# Altium schematic sheet RemoteSch.SchDoc: Remote Controller
size A3; Author: Neil Patil, Harris Tomy; Organization: The University of Auckland; Address1: Building 405; Address2: 20 Symonds Street; Address3: Auckland, 1010; Address4: New Zealand; Revision: 1R0; SheetNumber: 1; SheetTotal: ?
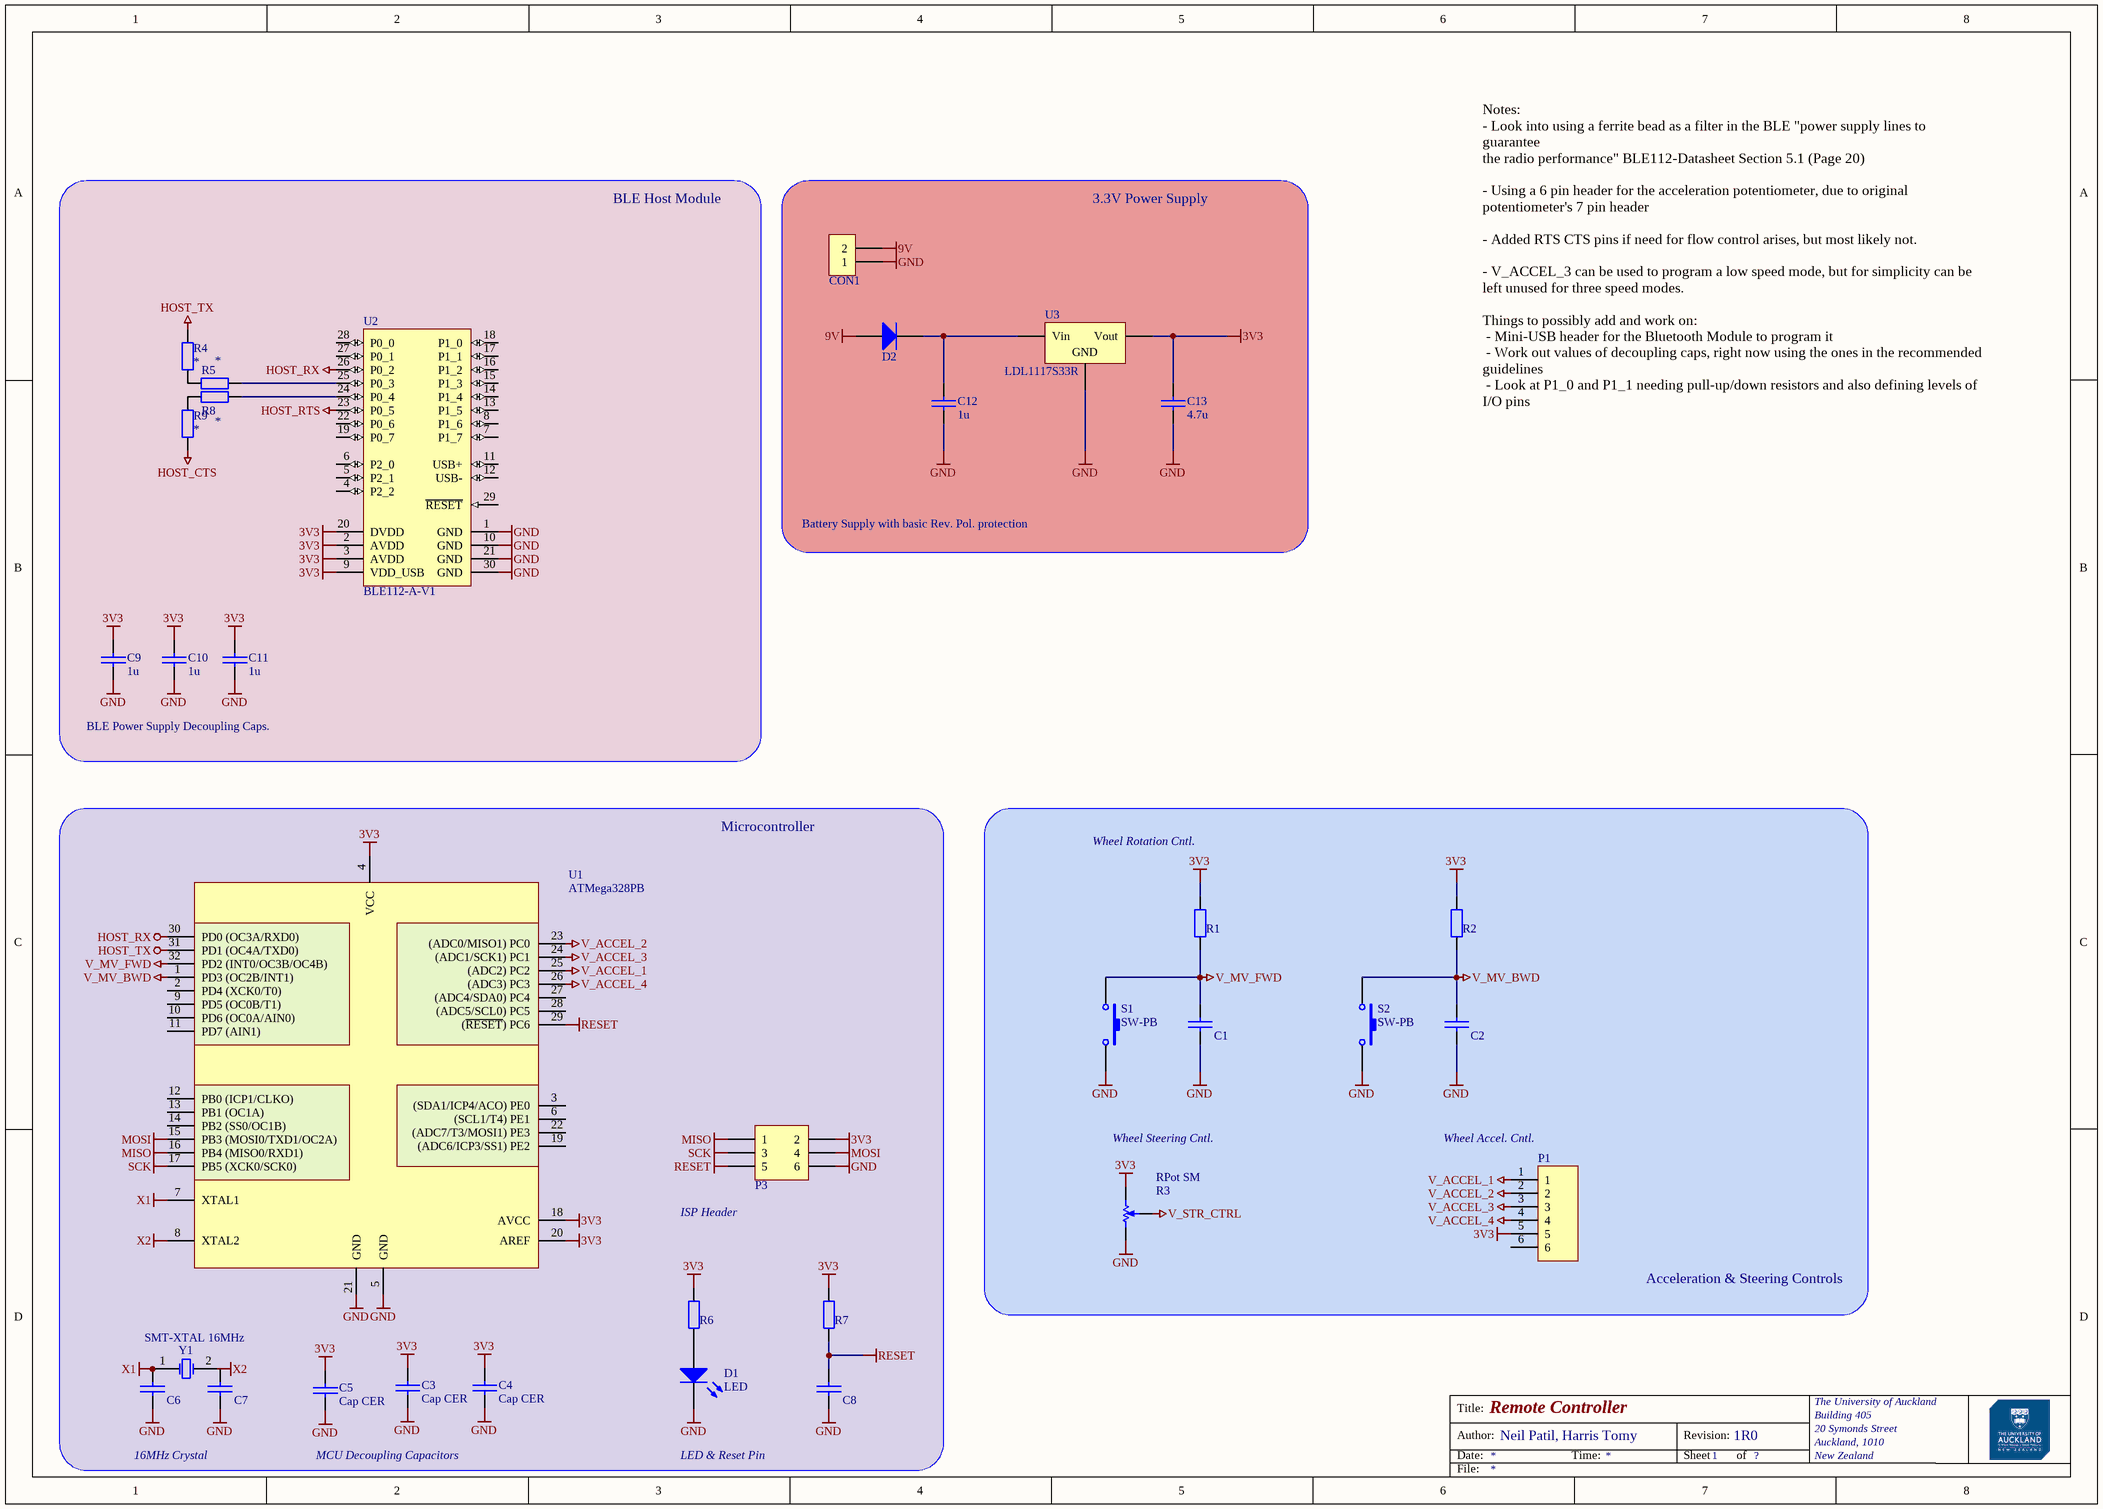
[diagram p0: RemoteSch.SchDoc]

## Parts
C1  Capacitor 0805  [C0805]  (value not drawn)
C2  Capacitor 0805  [C0805]  (value not drawn)
C3  Cap CER  [C1206]
C4  Cap CER  [C1206]
C5  Cap CER  [C1206]
C6  CCAP1210  [C1210]  (value not drawn)
C7  CCAP1210  [C1210]  (value not drawn)
C8  CCAP1210  [C1210]  (value not drawn)
C9  value 1u  [C0805]  (hidden comment: Capacitor 0805)
C10  value 1u  [C0805]  (hidden comment: Capacitor 0805)
C11  value 1u  [C0805]  (hidden comment: Capacitor 0805)
C12  1u  [C1210]
C13  4.7u  [C1210]
CON1  Header 2X1  [HDR2X1_2P54]  (value not drawn)
D1  LED  [R0805]
D2  Diode  [DAX4]  (value not drawn)
P1  Header 6X1  [HDR6X1_2P54]  (value not drawn)
P3  HDR3X2  [HDR2X3_2P54]  (value not drawn)
R1  Resistor 0805  [R0805]  (value not drawn)
R2  Resistor 0805  [R0805]  (value not drawn)
R3  RPot SM  [POT4MM-2]
R4  *  [0805 RES]
R5  *  [0805 RES]
R6  Resistor 1206  [R1206]  (value not drawn)
R7  Resistor 1206  [R1206]  (value not drawn)
R8  *  [0805 RES]
R9  *  [0805 RES]
S1  SW-PB  [SPST-2]
S2  SW-PB  [SPST-2]
U1  ATMega328PB  [TQFP32]
U2  BLE112-A-V1  [BLUE-BLE112-A-V1_V]
U3  LDL1117S33R  [SOT223L]
Y1  SMT-XTAL 16MHz  [HC49-US]

## Blocks framed on the sheet
BLE Host Module: C9-C11 R4 R5 R8 R9 U2
3.3V Power Supply: C12 C13 CON1 D2 U3
Microcontroller: C3-C8 D1 P3 R6 R7 U1 Y1
Acceleration & Steering Controls: C1 C2 P1 R1-R3 S1 S2

## Nets
3V3: C3.2 C4.2 C5.2 C9.2 C10.2 C11.2 C13.2 P1.5 P3.2 R1.1 R2.1 R3.CW(+) R6.2 R7.2 U1.4(VCC) U1.18(AVCC) U1.20(AREF) U2.2(AVDD) U2.3(AVDD) U2.9(VDD_USB) U2.20(DVDD) U3.2(Vout)
9V: CON1.2 D2.1
GND: C1.1 C2.1 C3.1 C4.1 C5.1 C6.1 C7.1 C8.1 C9.1 C10.1 C11.1 C12.1 C13.1 CON1.1 D1.2(K) P3.6 R3.CCW(-) S1.2 S2.2 U1.5(GND) U1.21(GND) U2.1(GND) U2.10(GND) U2.21(GND) U2.30(GND) U3.1(GND)
HOST_CTS: R9.1
HOST_RTS: U2.23(P0_5)
HOST_RX: U1.30(PD0_(OC3A/RXD0)) U2.26(P0_2)
HOST_TX: R4.1 U1.31(PD1_(OC4A/TXD0))
MISO: P3.1 U1.16(PB4_(MISO0/RXD1))
MOSI: P3.4 U1.15(PB3_(MOSI0/TXD1/OC2A))
RESET: C8.2 P3.5 R7.1 U1.29((~{RESET})_PC6)
SCK: P3.3 U1.17(PB5_(XCK0/SCK0))
V_ACCEL_1: P1.1 U1.25((ADC2)_PC2)
V_ACCEL_2: P1.2 U1.23((ADC0/MISO1)_PC0)
V_ACCEL_3: P1.3 U1.24((ADC1/SCK1)_PC1)
V_ACCEL_4: P1.4 U1.26((ADC3)_PC3)
V_MV_BWD: C2.2 R2.2 S2.1 U1.1(PD3_(OC2B/INT1))
V_MV_FWD: C1.2 R1.2 S1.1 U1.32(PD2_(INT0/OC3B/OC4B))
V_STR_CTRL: R3.W
X1: C6.2 U1.7(XTAL1) Y1.1(OSC1)
X2: U1.8(XTAL2)
NetC7_2: C7.2 Y1.2(OSC2)
NetC12_2: C12.2 D2.2 U3.3(Vin)
NetD1_1: D1.1(A) R6.1
NetR4_2: R4.2 R5.1
NetR5_2: R5.2 U2.25(P0_3)
NetR8_1: R8.1 R9.2
NetR8_2: R8.2 U2.24(P0_4)

Not connected (* = marked no-connect by the designer): P1 6; U1 2(PD4_(XCK0/T0)) 3((SDA1/ICP4/ACO)_PE0) 6((SCL1/T4)_PE1) 9(PD5_(OC0B/T1)) 10(PD6_(OC0A/AIN0)) 11(PD7_(AIN1)) 12(PB0_(ICP1/CLKO)) 13(PB1_(OC1A)) 14(PB2_(SS0/OC1B)) 19((ADC6/ICP3/SS1)_PE2) 22((ADC7/T3/MOSI1)_PE3) 27((ADC4/SDA0)_PC4) 28((ADC5/SCL0)_PC5); U2 4(P2_2) 5(P2_1) 6(P2_0) 7(P1_7) 8(P1_6) 11(USB+) 12(USB-) 13(P1_5) 14(P1_4) 15(P1_3) 16(P1_2) 17(P1_1) 18(P1_0) 19(P0_7) 22(P0_6) 27(P0_1) 28(P0_0) 29(~{RESET})

## Notes on the sheet
- Notes:
  - Look into using a ferrite bead as a filter in the BLE "power supply lines to guarantee
  the radio performance" BLE112-Datasheet Section 5.1 (Page 20)
  - Using a 6 pin header for the acceleration potentiometer, due to original potentiometer's 7 pin header
  - Added RTS CTS pins if need for flow control arises, but most likely not.
  - V_ACCEL_3 can be used to program a low speed mode, but for simplicity can be left unused for three speed modes.
  Things to possibly add and work on:
  - Mini-USB header for the Bluetooth Module to program it
  - Work out values of decoupling caps, right now using the ones in the recommended guidelines
  - Look at P1_0 and P1_1 needing pull-up/down resistors and also defining levels of I/O pins
- Battery Supply with basic Rev. Pol. protection
- BLE Power Supply Decoupling Caps.
- Wheel Rotation Cntl.
- Wheel Steering Cntl.
- (near P1) Wheel Accel. Cntl.
- (near P3) ISP Header
- 16MHz Crystal
- MCU Decoupling Capacitors
- LED & Reset Pin
- Labels drawn without touching a wire or pin: X2
- Title:
- Author:
- Date:
- Time:
- Revision:
- Sheet
- of
- File:

## Library data of the parts
C1 C2 = CCAP0805
C3-C5 = Cap CER Decoup C3216C0G2A104J160AC: CAP CER 0.1UF 100V C0G 1206; Manufacturer: TDK Corporation; Type: Surface mount; Value: 100nF/100V; Supplier 1: RSComponents; Supplier Part Number 1: 1795799; MPN: C3216C0G2A104J160AC; Supplier 2: Element14; Part Description: CAP CER 0.1UF 100V C0G 1206; Supplier Part Number 4: 810-C3216C0G2A104J6C; Supplier Part Number 3: 445-172677-1-ND; Supplier Part Number 2: 2906828; Supplier 4: Mouser; Supplier 3: Digi-Key
C6 C7 = CCAP1210: Type: Surface Mount; Value: 18p; MPN: ?; Part Description: ?
C9-C11 = CCAP0805: Type: Surface Mount; MPN: ?; Part Description: ?
C12 C13 = Cap CER HF DC-Link CL32B225KCJSNNE: CAP CER 2.2UF 100V X7R 1210; Manufacturer: AVX Corporation; Type: Surface mount; Value: 2200nF/100V; MPN: CL32B225KCJSNNE; Part Description: CAP CER 2.2UF 100V X7R 1210; Supplier 1: Digi-Key; Supplier Part Number 1: 1276-3362-1-ND; Supplier 2: Arrow
CON1 = HDR2X1
P1 = HDR6X1: Header, 6-Pin; LatestRevisionDate: 17-Jul-2002; LatestRevisionNote: Re-released for DXP Platform.; Publisher: Altium Limited
P3 = HDR3X2: Header, 3-Pin, Dual row
R1 R2 = RES0805
R3 = RPot SM: Square Trimming Potentiometer; Published: 17-Dec-2003; DatasheetVersion: Oct-2003; PackageReference: POT4MM-2; Publisher: Altium Limited; PackageDescription: Square Trimming Potentiometer; ComponentLink1Description: Manufacturer Link; ComponentLink1URL: http://bourns.com/2/search.html
R4 R5 R8 R9 = Res_SMT_0805: 0805 resistor; Published: 8-Jun-2000; LatestRevisionDate: 17-Jul-2002; LatestRevisionNote: Re-released for DXP Platform.; PackageReference: AXIAL-0.4; Publisher: Altium Limited; Value: *; ComponentLink1Description: https://nz.mouser.com/datasheet/2/315/AOA0000C304-1149620.pdf
R6 R7 = RES1206
S1 S2 = SW-PB: Switch; Published: 24-Mar-1999; LatestRevisionDate: 17-Jul-2002; LatestRevisionNote: Re-released for DXP Platform.; PackageReference: SPST-2; Publisher: Altium Limited; PackageDescription: Switch; 2 Leads
U1 = ATMega328PB: IC MCU 8BIT 32KB FLASH 32TQFP; Supplier 1: Digi-Key; Supplier Part Number 1: ATMEGA328PB-AU-ND; Supplier 2: Digikey; Supplier Part Number 2: ATMEGA328PB-AU-ND
U2 = BLE112-A-V1: Bluetooth(R) Low Energy Single Mode Module / , 2 to 3.6 V, -40 to 85 degC, 30-Pin SMD, RoHS, Tape and Reel; Min Supply Voltage: 2.1 V; Max Supply Voltage: 3.6 V; RoHSCompliant: true; ComponentLink1Description: Manufacturer URL; Min Operating Temperature: -40 degC; ComponentLink2Description: Datasheet; DatasheetVersion: Rev. 1.4, 05/2013; ComponentLink1URL: www.bluegiga.com; Packaging: Cut Tape; Pins: 64; REACH SVHC: No SVHC; Max Operating Temperature: 85 degC; PackageDescription: 30-Pin Surface Mount Device, Body 12.05 x 18.1 mm, Pitch 1.25 mm; ComponentLink2URL: http://www.mouser.com/ds/2/368/Bluegiga_Technologies_BLE112_Datasheet-558666.pdf; PackageReference: BLE112-A-V1; PartNumber: BLE112-A-V1
U3 = LDO LDL1117S33R: IC REG LINEAR 3.3V 1.2A SOT223; Manufacturer: STMicroelectronics; Value: 3.3V/1.2A; MPN: LDL1117S33R; Supplier 1: Element14; Type: Surface mount; Part Description: IC REG LINEAR 3.3V 1.2A SOT223; Supplier Part Number 3: 511-LDL1117S33R; Supplier Part Number 2: 497-17239-1-ND; Supplier Part Number 1: 2729708; Supplier 3: Mouser; Supplier 2: Digi-Key
Y1 = TXC9C-16_XTAL_SMT: 9C-16.000MAAJ-T crystal 16.0000MHZ 18PF SMD; Manufacturer: TXC CORPORATION; Frequency Stability: ±30ppm; Operating Mode: Fundamental; Supplier 1: Digi-Key; Manufacturer Part Number: 9C-16.000MAAJ-T; RoHS: RoHS Compliant; Category: Crystals, Oscillators, Resonators; Stock 1: 11514; Pricing 1: 1=0.75, 10=0.628, 50=0.5656, 100=0.5026, 500=0.47744 (NZD); Packaging: Cut Tape (CT); Part Status: Active; Type: MHz Crystal; Frequency Tolerance: ±30ppm; Load Capacitance: 18pF; Operating Temperature: -20°C ~ 70°C; Ratings: -; Mounting Type: Surface Mount; Package / Case: HC-49/US; Size / Dimension: 0.449" L x 0.189" W (11.40mm x 4.80mm); Height - Seated (Max): 0.161" (4.10mm); ComponentLink1URL: http://www.txccorp.com/download/products/quartz_crystals/2015TXC_9C_32.pdf; ComponentLink1Description: http://www.txccorp.com/download/products/quartz_crystals/2015TXC_9C_32.pdf; Supplier Part Number 1: 887-1059-1-ND